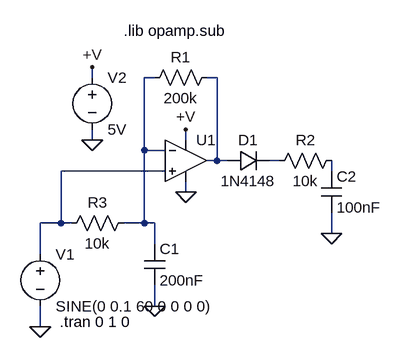
[diagram p0: schematic medidor capacitivo.asc]
medidor capacitivo.asc, the LTspice schematic file:
Version 4
SHEET 1 880 680
WIRE 0 -16 0 -32
WIRE 96 -16 80 -16
WIRE 192 -16 176 -16
WIRE 0 80 0 64
WIRE 144 80 144 64
WIRE 80 96 80 -16
WIRE 112 96 80 96
WIRE 192 112 192 -16
WIRE 192 112 176 112
WIRE 208 112 192 112
WIRE 288 112 272 112
WIRE 112 128 -48 128
WIRE 368 128 368 112
WIRE 144 160 144 144
WIRE -48 208 -48 128
WIRE -48 208 -80 208
WIRE -32 208 -48 208
WIRE 80 208 80 96
WIRE 80 208 48 208
WIRE 96 208 80 208
WIRE 368 224 368 192
WIRE 96 240 96 208
WIRE -80 256 -80 208
WIRE 96 336 96 304
WIRE -80 368 -80 336
FLAG -80 368 0
FLAG 0 -32 +V
FLAG 144 64 +V
FLAG 96 336 0
FLAG 0 80 0
FLAG 144 160 0
FLAG 368 224 0
SYMBOL voltage -80 240 R0
WINDOW 123 0 0 Left 2
WINDOW 39 0 0 Left 2
SYMATTR InstName V1
SYMATTR Value SINE(0 0.1 60 0 0 0 0)
SYMATTR Value2 ""
SYMATTR SpiceLine ""
SYMBOL voltage 0 -32 R0
WINDOW 123 0 0 Left 2
WINDOW 39 0 0 Left 2
SYMATTR InstName V2
SYMATTR Value 5V
SYMATTR Value2 ""
SYMATTR SpiceLine ""
SYMBOL Opamps\\UniversalOpamp2 144 112 R0
SYMATTR InstName U1
SYMBOL res -48 224 R270
WINDOW 0 32 56 VTop 2
WINDOW 3 0 56 VBottom 2
SYMATTR InstName R3
SYMATTR Value 10k
SYMBOL cap 80 240 R0
SYMATTR InstName C1
SYMATTR Value 200nF
SYMBOL res 192 -32 R90
WINDOW 0 0 56 VBottom 2
WINDOW 3 32 56 VTop 2
SYMATTR InstName R1
SYMATTR Value 200k
SYMBOL diode 208 128 R270
WINDOW 0 32 32 VTop 2
WINDOW 3 0 32 VBottom 2
SYMATTR InstName D1
SYMATTR Value 1N4148
SYMBOL res 272 128 R270
WINDOW 0 32 56 VTop 2
WINDOW 3 0 56 VBottom 2
SYMATTR InstName R2
SYMATTR Value 10k
SYMBOL cap 352 128 R0
SYMATTR InstName C2
SYMATTR Value 100nF
TEXT -50 360 Left 2 !.tran 0 1 0
TEXT 48 -88 Left 2 !.lib opamp.sub

The netlist it stands for:
* medidor capacitivo.asc
V1 N004 0 SINE(0 0.1 60 0 0 0 0)
V2 +V 0 5V
XU1 N004 N001 +V 0 N002 level.2 Avol=1Meg GBW=10Meg Slew=10Meg ilimit=25m rail=0 Vos=0 phimargin=45 en=0 enk=0 in=0 ink=0 Rin=500Meg  ; pins IN+ IN- V+ V- OUT
R3 N004 N001 10k
C1 N001 0 200nF
R1 N002 N001 200k
D1 N002 N003 1N4148
R2 N003 N005 10k
C2 N005 0 100nF
.model D D
.lib standard.dio
.tran 0 1 0
.lib opamp.sub
.lib UniversalOpamps2.sub
.backanno
.end